# Altium project PhaseShifter.PrjPcb (part 2 of 2)

## Sheet Demod.SchDoc
size 431 x 279 mm; PartNumber: PNXXXXXXX; Organization: ORGANIZATION; Address1: 207; Address2: 13399 104 Ave; Address3: Surrey BC, V3T 0C9; Address4: Canada; Revision: V0.0.0; SheetNumber: 2; SheetTotal: 3; ENG_APP_DATE: --/--/--; DSN_APP_DATE: --/--/--; CHK_APP_DATE: --/--/--
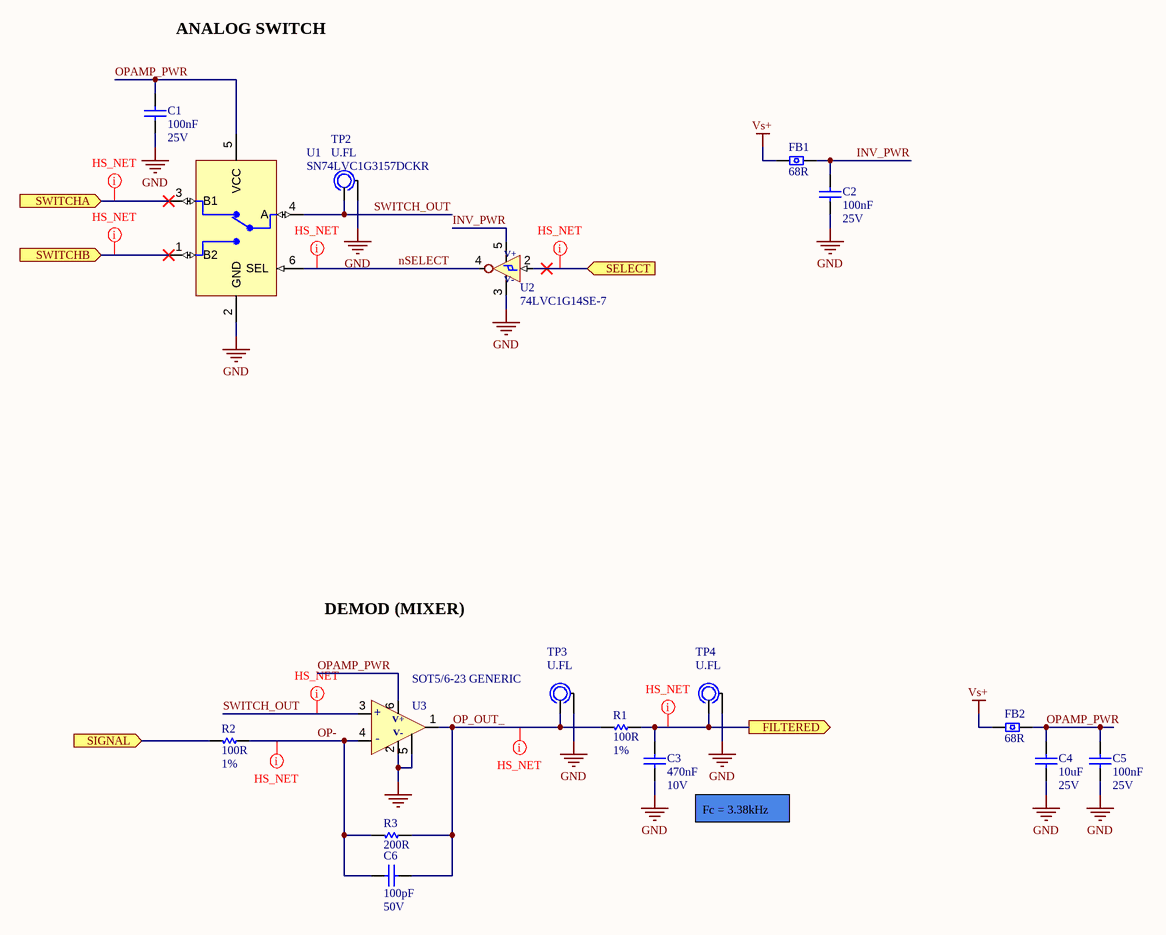
[diagram p1: Demod.SchDoc]

### Parts
C1  100nF  Voltage Rating: 25V  [C0402]
C2  100nF  Voltage Rating: 25V  [C0402]
C3  470nF  Voltage Rating (DC): 10V  [C0402]
C4  10uF  Voltage Rating: 25V  [c0805]
C5  100nF  Voltage Rating: 25V  [C0402]
C6  100pF  Voltage Rating (DC): 50V  [C0402]
FB1  68R  [FB0402]
FB2  68R  [FB0402]
R1  100R  Tolerance: 1%  [R0402]
R2  100R  Tolerance: 1%  [R0402]
R3  200R  [R0402]
TP2  U.FL  [U.FL]
TP3  U.FL  [U.FL]
TP4  U.FL  [U.FL]
U1  SN74LVC1G3157DCKR  [SC70-6]
U2  74LVC1G14SE-7  [SC70 5pin TI DCK]
U3  SOT5/6-23 GENERIC  [SOT23-5/6_Modified]

### Ports
FILTERED (out), SELECT (in), SIGNAL (in), SWITCHA (in), SWITCHB (in)

### Nets
GND: C1.2 C2.2 C3.1 C4.1 C5.2 TP2.0 TP3.0 TP4.0 U1.2(GND) U2.3(GND) U3.2(V-) U3.5
Vbias: U1.3(B1) ; port SWITCHA
Vs+: FB1.2 FB2.2
CLOCK: U2.2(A) ; port SELECT
INV_PWR: C2.1 FB1.1 U2.5(PWR)
nSELECT: U1.6(SEL) U2.4(Y)
OP-: C6.2 R2.1 R3.2 U3.4(-)
OP_OUT_: C6.1 R1.2 R3.1 TP3.1 U3.1
OPAMP_PWR: C1.1 C4.2 C5.1 FB2.1 U1.5(VCC) U3.6(V+)
OSIG_I: C3.2 R1.1 TP4.1 ; port FILTERED
PHASE_DELAY: R2.2 U1.1(B2) ; port SIGNAL, port SWITCHB
SWITCH_OUT: TP2.1 U1.4(A) U3.3(+)

### Layout directives
net class HS_NET; rule Clearance Constraint [Generic clearance = 10mil, and 30 value(s) for objects]; rule Impedance Constraint [Min = 42.50    Max = 57.50    ]: CLOCK, nSELECT, OP-, OP_OUT_, OSIG_I, PHASE_DELAY, SWITCH_OUT, Vbias

### Notes on the sheet
- ANALOG SWITCH
- DEMOD (MIXER)
- (near C3) Fc = 3.38kHz
- REV:
- PROJECT:
- DATE:
- TITLE
- SHEET
- OF
- DESIGNED:
- REVIEWED:
- (in symbol IC LOGIC INVERTER 32mA) V+; V-

### Library data of the parts
C1 C2 C5 = CAP CER 100nF 25V X5R 0402: Cap Ceramic 0.1uF 25V X5R 10% Pad SMD 0402 85¡ãC T/R / Multi Layer Ceramic Capacitor (MLCC); Manufacturer: Samsung; Manufacturer Part Number: CL05A104KA5NNNC; Supplier 1: Digi-Key; RoHS: Yes; Category: Ceramic Capacitors; Stock 1: 8053194; Pricing 1: 1=0.10000, 10=0.01100, 50=0.00600, 100=0.00490, 500=0.00346, 1000=0.00272, 2500=0.00248, 5000=0.00228 (USD); Mount: Surface Mount; Case/Package: 0402; Case Code (Metric): 1005; Case Code (Imperial): 0402; Min Operating Temperature: -55°C; Max Operating Temperature: 85°C; Capacitance: 100nF; Tolerance: 10%; Dielectric: X5R; Packaging: Tape and Reel; Package Quantity: 1; Voltage: 25V; Series: CL; Construction: Flat; Voltage Rating (DC): 25V; Length: 1mm; Width: 0.02inch; Height: 0.5mm; Thickness: 0.022inch; Depth: 0.5mm; Radiation Hardening: No; Lead Free: Lead Free; ComponentLink1URL: https://datasheet.ciiva.com/25802/cl05a104ka5nnnc-25802704.pdf?src-supplier=Digi-Key; ComponentLink1Description: https://datasheet.ciiva.com/25802/cl05a104ka5nnnc-25802704.pdf?src-supplier=Digi-Key; ComponentLink2URL: https://datasheet.ciiva.com/26838/getdatasheetpartid-357412-26838142.pdf?src-supplier=Verical; ComponentLink2Description: https://datasheet.ciiva.com/26838/getdatasheetpartid-357412-26838142.pdf?src-supplier=Verical; ComponentLink3URL: https://datasheet.ciiva.com/16437/cl05a104ka5nnnc-16437369.pdf?src-supplier=Future+Electronics; ComponentLink3Description: https://datasheet.ciiva.com/16437/cl05a104ka5nnnc-16437369.pdf?src-supplier=Future+Electronics; ComponentLink4URL: https://datasheet.ciiva.com/26309/mlcc-catalogdownload2013-eng-26309014.pdf?src-supplier=Distrelec; ComponentLink4Description: https://datasheet.ciiva.com/26309/mlcc-catalogdownload2013-eng-26309014.pdf?src-supplier=Distrelec; Supplier Part Number 1: 1276-1043-1-ND
C3 = CAP CER 470nF 10V X7R 0402: Multilayer Ceramic Capacitor, 0.47 uF, 50 V, ± 2%, C0G (NP0), 0402 [1005 Metric]; Manufacturer 1: Yageo; Manufacturer Part Number 1: CC0402KRX7R6BB474; Category 1: Ceramic Capacitors; Tolerance: 10%; Dielectric: X7R; Supplier 1: Newark; Supplier Part Number 1: 09AK0987; RoHS 1: Yes; Description 1: Multilayer Ceramic Capacitor, 0.47 uF, 50 V, ± 2%, C0G (NP0), 0402 [1005 Metric]; Stock 1: 9400; Pricing 1: 1=0.238, 10=0.142 (USD); Mounting Technology: Surface Mount; Case/Package: 0402; Min Operating Temperature: -55°C; Max Operating Temperature: 125°C; Packaging: Tape and Reel; Value: 470nF; Voltage Rating: 10V; Series: CC; Length: 0.039inch; Width: 0.02inch; Thickness: 0.022inch; Lead Free: Lead Free; Halogen Free: Halogen Free; RoHS Compliant: Yes; ComponentLink1URL: http://www.yageo.com/documents/recent/UPY-GPHC_X7R_6.3V-to-50V_18.pdf?src-supplier=Digi-Key; ComponentLink1Description: http://www.yageo.com/documents/recent/UPY-GPHC_X7R_6.3V-to-50V_18.pdf?src-supplier=Digi-Key; ComponentLink2URL: https://datasheet.octopart.com/CC0402KRX7R6BB474-Yageo-datasheet-151948686.pdf?src-supplier=Farnell; ComponentLink2Description: https://datasheet.octopart.com/CC0402KRX7R6BB474-Yageo-datasheet-151948686.pdf?src-supplier=Farnell; ComponentLink3URL: https://datasheet.octopart.com/CC0402KRX7R6BB474-Yageo-datasheet-166511530.pdf?src-supplier=Future+Electronics; ComponentLink3Description: https://datasheet.octopart.com/CC0402KRX7R6BB474-Yageo-datasheet-166511530.pdf?src-supplier=Future+Electronics
C4 = CAP CER 10uF 25V X5R 0805: Cap Ceramic 10uF 25V X5R 10% SMD 0805 85°C Embossed T/R; Manufacturer: Samsung; Manufacturer Part Number: CL21A106KAYNNNE; Supplier 1: Digi-Key; RoHS: Yes; Category: Ceramic Capacitors; Stock 1: 2266338; Pricing 1: 2000=0.03549, 4000=0.03247 (USD); Mount: Surface Mount; Case/Package: 0805; Case Code (Metric): 2012; Case Code (Imperial): 0805; Min Operating Temperature: -55°C; Max Operating Temperature: 85°C; Package Quantity: 1; Packaging: Tape and Reel; Capacitance: 10uF; Tolerance: 10%; Dielectric: X5R; Series: CL; Construction: Flat; Length: 2mm; Width: 0.049inch; Height: 1.25mm; Depth: 1.25mm; Thickness: 0.057inch; Radiation Hardening: No; RoHS Compliant: Yes; ComponentLink1URL: https://datasheet.ciiva.com/25796/cl21a106kaynnne-25796720.pdf?src-supplier=Digi-Key; ComponentLink1Description: https://datasheet.ciiva.com/25796/cl21a106kaynnne-25796720.pdf?src-supplier=Digi-Key; ComponentLink2URL: https://datasheet.ciiva.com/26838/getdatasheetpartid-357558-26838583.pdf?src-supplier=Verical; ComponentLink2Description: https://datasheet.ciiva.com/26838/getdatasheetpartid-357558-26838583.pdf?src-supplier=Verical; Supplier Part Number 1: 1276-2891-2-ND
C6 = CAP CER 100pF 50V C0G 0402: 0402 100 pF 50 V ±5% Tolerance NP0/C0G Multilayer Ceramic Chip Capacitor; Manufacturer: Yageo; Manufacturer Part Number: CC0402JPNPO9BN101; Dielectric: C0G; Supplier 1: Digi-Key; RoHS: Yes; Category: Ceramic Capacitors; Stock 1: 83787; Pricing 1: 1=0.10000, 10=0.01900, 50=0.01040, 100=0.00850, 500=0.00604, 1000=0.00475, 2500=0.00432, 5000=0.00397 (USD); Case/Package: 0402; Case Code (Imperial): 0402; Case Code (Metric): 1005; Weight: 2.3E-05oz; Min Operating Temperature: -55°C; Max Operating Temperature: 125°C; Tolerance: 5%; Packaging: Tape and Reel; Capacitance: 100pF; Termination: SMD/SMT; Resistor Type: Ceramic; Length: 1mm; Width: 0.5mm; Depth: 0.5mm; RoHS Compliant: Yes; ComponentLink1URL: http://www.mouser.com/ds/2/447/Yageo_UPY-GP_NP0_16V-to-50V_9-358835.pdf?src-supplier=Mouser; ComponentLink1Description: http://www.mouser.com/ds/2/447/Yageo_UPY-GP_NP0_16V-to-50V_9-358835.pdf?src-supplier=Mouser; ComponentLink2URL: http://components.arrow.com/part/dataview/0323_04038301?src-supplier=Arrow+Europe; ComponentLink2Description: http://components.arrow.com/part/dataview/0323_04038301?src-supplier=Arrow+Europe; Supplier Part Number 1: 13-CC0402JPNPO9BN101CT-ND
FB1 FB2 = FB 68R 400mA 310mR 0402: Ferrite Beads Multi-Layer 68Ohm 25% 100MHz 400mA 310mOhm DCR 0402 T/R; Manufacturer: Taiyo Yuden; Manufacturer Part Number: BK1005LL680-T; DC Resistance (DCR): 310mR; Number of Lines: 1; Shielding: Unshielded; Supplier 1: Digi-Key; RoHS: Yes; Category: Ferrite Beads and Chips; Stock 1: 9707; Pricing 1: 1=0.10000, 10=0.04100, 25=0.03640, 50=0.03300, 100=0.02970, 250=0.02176, 500=0.01584, 1000=0.01551, 5000=0.01056 (USD); Mount: Surface Mount; Case/Package: 0402; Number of Pins: 2; Case Code (Metric): 1005; Case Code (Imperial): 0402; Core Material: Ferrite; Min Operating Temperature: -55°C; Max Operating Temperature: 125°C; Packaging: Tape and Reel; Package Quantity: 1; Impedance: 68R; Tolerance: 25%; Max DC Current: 400mA; Termination: SMD/SMT; Test Frequency: 100MHz; Max Current Rating: 400mA; Series: BK; Frequency: 100MHz; Length: 0.039inch; Width: 0.02inch; Height: 0.022inch; Depth: 0.55mm; Halogen Free: Halogen Free; Lead Free: Lead Free; REACH SVHC: Unknown; ComponentLink1URL: https://datasheet.ciiva.com/1013/bk1005ll680-t-ss-1013936.pdf?src-supplier=Digi-Key; ComponentLink1Description: https://datasheet.ciiva.com/1013/bk1005ll680-t-ss-1013936.pdf?src-supplier=Digi-Key; ComponentLink2URL: https://datasheet.ciiva.com/1013/mlci07-e-1013935.pdf?src-supplier=Digi-Key; ComponentLink2Description: https://datasheet.ciiva.com/1013/mlci07-e-1013935.pdf?src-supplier=Digi-Key; ComponentLink3URL: https://datasheet.ciiva.com/1013/mlci07-e-1013937.pdf?src-supplier=Digi-Key; ComponentLink3Description: https://datasheet.ciiva.com/1013/mlci07-e-1013937.pdf?src-supplier=Digi-Key; Supplier Part Number 1: 587-1860-1-ND
R1 R2 = RES 100R 63mW 1% 0402: Res General Purpose Thick Film 0402 100 Ohm 1% 1/16W ±100ppm/°C Molded SMD Paper T/R; Manufacturer: Yageo; Manufacturer Part Number: RC0402FR-07100RL; Power Rating: 62.5mW; Voltage Rating: 50V; Max Power Dissipation: 63mW; Supplier 1: Newark; RoHS: Yes; Category: Chip SMD Resistors; Stock 1: 4390000; Pricing 1: 1=0.00100, 10000=0.00100 (USD); Case/Package: 0402; Number of Pins: 2; Case Code (Imperial): 0402; Case Code (Metric): 1005; Size Code: 0402; Min Operating Temperature: -55°C; Max Operating Temperature: 155°C; Voltage Rating (DC): 50V; Resistance: 100R; Packaging: Tape and Reel; Termination: SMD/SMT; Resistor Type: Thick Film; Temperature Coefficient: 100ppm/°C; Features: Moisture Resistant; Series: RC; Number of Terminations: 2; Resistance Tolerance: 1%; Construction: Rectangular; Technology: THICK FILM; Length: 1mm; Width: 0.5mm; Height: 0.32mm; Depth: 0.5mm; RoHS Compliant: Yes; Reach SVHC Compliant: Yes; Military Standard: Not; Lead Free: Lead Free; ComponentLink1URL: https://datasheet.ciiva.com/11808/0900766b80c66297-11808765.pdf?src-supplier=RSComponents; ComponentLink1Description: https://datasheet.ciiva.com/11808/0900766b80c66297-11808765.pdf?src-supplier=RSComponents; ComponentLink2URL: https://datasheet.ciiva.com/7849/1784430-7849810.pdf?src-supplier=Element14; ComponentLink2Description: https://datasheet.ciiva.com/7849/1784430-7849810.pdf?src-supplier=Element14; ComponentLink3URL: https://datasheet.ciiva.com/28367/1018594-28367226.pdf?src-supplier=Element14; ComponentLink3Description: https://datasheet.ciiva.com/28367/1018594-28367226.pdf?src-supplier=Element14; ComponentLink4URL: https://datasheet.ciiva.com/22747/1018594-22747511.pdf?src-supplier=Element14; ComponentLink4Description: https://datasheet.ciiva.com/22747/1018594-22747511.pdf?src-supplier=Element14; ComponentLink5URL: https://datasheet.ciiva.com/12667/pyu-rc0402-51-rohs-l-6-r-12667957.pdf?src-supplier=Mouser; ComponentLink5Description: https://datasheet.ciiva.com/12667/pyu-rc0402-51-rohs-l-6-r-12667957.pdf?src-supplier=Mouser; ComponentLink6URL: https://datasheet.ciiva.com/15189/getdatasheetpartid-329466-15189335.pdf?src-supplier=Verical; ComponentLink6Description: https://datasheet.ciiva.com/15189/getdatasheetpartid-329466-15189335.pdf?src-supplier=Verical; ComponentLink7URL: https://datasheet.ciiva.com/16740/pyu-rc0402-51-rohs-l-6-r-16740566.pdf?src-supplier=Future+Electronics; ComponentLink7Description: https://datasheet.ciiva.com/16740/pyu-rc0402-51-rohs-l-6-r-16740566.pdf?src-supplier=Future+Electronics; Supplier Part Number 1: 45Y6897
R3 = RES 200R 1% 63mW 0402: SMD Chip Resistor, 200 Ohm, ± 1%, 63 mW, 0402 [1005 Metric], Thick Film, General Purpose; Manufacturer 1: Yageo; Manufacturer Part Number 1: RC0402FR-07200RL; Category 1: Chip SMD Resistors; Temperature Coefficient: 100ppm/°C; Power Rating: 63mW; Voltage Rating (DC): 50V; Supplier 1: Future Electronics; Supplier Part Number 1: 5740899; RoHS 1: Yes; Description 1: SMD Chip Resistor, 200 Ohm, ± 1%, 63 mW, 0402 [1005 Metric], Thick Film, General Purpose; Stock 1: 4960000; Pricing 1: 10000=0.0012, 50000=0.0011, 300000=0.0011, 1000000=0.001, 3000000=0.0009 (USD); Case/Package: 0402; Case Code (Metric): 1005; Case Code (Imperial): 0402; Min Operating Temperature: -55°C; Max Operating Temperature: 155°C; Tolerance: 1%; Packaging: Tape and Reel; Value: 200R; Resistor Type: Thick Film; Termination: SMD/SMT; Voltage Rating: 50V; Package Quantity: 1; Number of Terminations: 2; Max Power Dissipation: 63mW; Features: Moisture Resistant; Series: RC; Construction: Rectangular; Resistance Tolerance: 1%; Length: 1mm; Width: 0.02inch; Height: 0.016inch; Depth: 0.5mm; RoHS Compliant: Yes; Reach SVHC Compliant: No; Lead Free: Lead Free; Military Standard: Not; ComponentLink1URL: https://datasheet.ciiva.com/7849/1018594-7849899.pdf?src-supplier=Element14; ComponentLink1Description: https://datasheet.ciiva.com/7849/1018594-7849899.pdf?src-supplier=Element14; ComponentLink2URL: https://datasheet.ciiva.com/7849/1018594-7849898.pdf?src-supplier=Element14; ComponentLink2Description: https://datasheet.ciiva.com/7849/1018594-7849898.pdf?src-supplier=Element14; ComponentLink3URL: https://datasheet.ciiva.com/7983/1018594-7983509.pdf?src-supplier=Element14; ComponentLink3Description: https://datasheet.ciiva.com/7983/1018594-7983509.pdf?src-supplier=Element14; ComponentLink4URL: https://datasheet.ciiva.com/2553/pyu-r-int-thick-7-2553231.pdf?src-supplier=Digi-Key; ComponentLink4Description: https://datasheet.ciiva.com/2553/pyu-r-int-thick-7-2553231.pdf?src-supplier=Digi-Key; ComponentLink5URL: https://datasheet.ciiva.com/2553/pyu-r-int-thick-7-2553232.pdf?src-supplier=Digi-Key; ComponentLink5Description: https://datasheet.ciiva.com/2553/pyu-r-int-thick-7-2553232.pdf?src-supplier=Digi-Key; ComponentLink6URL: https://datasheet.ciiva.com/2553/pyu-r-int-thick-7-2553230.pdf?src-supplier=Digi-Key; ComponentLink6Description: https://datasheet.ciiva.com/2553/pyu-r-int-thick-7-2553230.pdf?src-supplier=Digi-Key; ComponentLink7URL: https://datasheet.ciiva.com/5562/pyu-rc0402-51-rohs-l-6-r-8721-5562539.pdf?src-supplier=Mouser; ComponentLink7Description: https://datasheet.ciiva.com/5562/pyu-rc0402-51-rohs-l-6-r-8721-5562539.pdf?src-supplier=Mouser; ComponentLink8URL: https://datasheet.ciiva.com/16804/pyu-rc0402-51-rohs-l-6-r-16804406.pdf?src-supplier=Future+Electronics; ComponentLink8Description: https://datasheet.ciiva.com/16804/pyu-rc0402-51-rohs-l-6-r-16804406.pdf?src-supplier=Future+Electronics; ComponentLink9URL: https://datasheet.ciiva.com/15189/getdatasheetpartid-331152-15189383.pdf?src-supplier=Verical; ComponentLink9Description: https://datasheet.ciiva.com/15189/getdatasheetpartid-331152-15189383.pdf?src-supplier=Verical
TP2-TP4 = TP U.FL: CONN U.FL RCPT STR 50 OHM SMD; Manufacturer: Hirose; Manufacturer Part Number: U.FL-R-SMT-1(80); Body Material: Bronze; Body Plating: Silver; Center Contact Plating: Gold; Dielectric Material: Polymer; Connector Type: Receptacle,Male Pin; Impedance: 50R; Max Frequency: 6GHz; Number of Ports: 1; Mating Cycles: 30; Supplier 1: Future Electronics; RoHS: Yes; Category: RF / Coaxial Connectors; Stock 1: 40000; Pricing 1: 10000=0.81500, 20000=0.80000, 30000=0.78500 (USD); Mount: Surface Mount; Case/Package: SMD/SMT; Contact Material: Brass; Housing Color: Beige; Min Operating Temperature: -40°C; Max Operating Temperature: 90°C; Package Quantity: 10000; Packaging: Tape and Reel; Fastening Type: SNAP-ON; Series: U.FL; Termination: Solder; Lead Free: Lead Free; RoHS Compliant: Yes; ComponentLink1URL: http://www.mouser.com/ds/2/185/U.FL_catalog-939761.pdf?src-supplier=Mouser; ComponentLink1Description: http://www.mouser.com/ds/2/185/U.FL_catalog-939761.pdf?src-supplier=Mouser; ComponentLink2URL: https://www.hirose.com/product/en/download_file/key_name/U.FL-R-SMT-1%2880%29/category/Specification%20Sheet/doc_file_id/37638/?file_category_id=9&item_id=03310472280&is_series=&src-supplier=Digi-Key; ComponentLink2Description: https://www.hirose.com/product/en/download_file/key_name/U.FL-R-SMT-1%2880%29/category/Specification%20Sheet/doc_file_id/37638/?file_category_id=9&item_id=03310472280&is_series=&src-supplier=Digi-Key
U1 = IC AN SWITCH SPDT 340MHz 15R SN74LVC1G3157DCKR: 5-V, 2: 1 (SPDT), 1-channel general-purpose analog switch 6-SC70 -40 to 125; Manufacturer 1: Texas Instruments; Category 1: Interface ICs; Min Supply Voltage: 1.65V; Max Supply Voltage: 5.5V; Number of Channels: 1; Bandwidth: 300MHz; Number of Outputs: 2; Turn-On Delay Time: 5.7ns; Turn-Off Delay Time: 3.8ns; Max Supply Current: 10uA; Supply Type: Single; Propagation Delay: 300ps; -3db Bandwidth: 340MHz; Supplier 1: Mouser; Supplier Part Number 1: 595-SN74LVC1G3157DCK; Manufacturer Part Number 1: SN74LVC1G3157DCKR; RoHS 1: Yes; Description 1: 5-V, 2: 1 (SPDT), 1-channel general-purpose analog switch 6-SC70 -40 to 125; Stock 1: 368361; Pricing 1: 1=0.34, 10=0.22, 50=0.22, 100=0.118, 1000=0.086, 10000=0.051 (USD); Mounting Technology: Surface Mount; Case/Package: SC; Pins: 6; Weight: 8.8E-05oz; Min Operating Temperature: -40°C; Max Operating Temperature: 125°C; Packaging: Tape and Reel; Number of Inputs: 1; Termination: SMD/SMT; Number of Bits: 1; Series: -; Number of Circuits: 1; Supply Current: 10uA; Length: 2mm; Width: 1.25mm; Height: 0.9mm; Radiation Hardening: No; RoHS Compliant: Yes; Reach SVHC Compliant: No; Lead Free: Lead Free; ComponentLink1URL: https://datasheet.ciiva.com/34301/756764-34301477.pdf?src-supplier=Jameco; ComponentLink1Description: https://datasheet.ciiva.com/34301/756764-34301477.pdf?src-supplier=Jameco; ComponentLink2URL: https://datasheet.ciiva.com/15127/getdatasheetpartid-187022-15127388.pdf?src-supplier=Verical; ComponentLink2Description: https://datasheet.ciiva.com/15127/getdatasheetpartid-187022-15127388.pdf?src-supplier=Verical; ComponentLink3URL: https://datasheet.ciiva.com/41461/001187224-da-01-en-ic-switch-sn74lvc1g3157dckr-sc-70-6-tid-41461882.pdf?src-supplier=Conrad; ComponentLink3Description: https://datasheet.ciiva.com/41461/001187224-da-01-en-ic-switch-sn74lvc1g3157dckr-sc-70-6-tid-41461882.pdf?src-supplier=Conrad; ComponentLink4URL: https://datasheet.ciiva.com/1514/1857156-1514550.pdf?src-supplier=Element14; ComponentLink4Description: https://datasheet.ciiva.com/1514/1857156-1514550.pdf?src-supplier=Element14; ComponentLink5URL: https://datasheet.ciiva.com/46411/1786793-46411528.pdf?src-supplier=Element14; ComponentLink5Description: https://datasheet.ciiva.com/46411/1786793-46411528.pdf?src-supplier=Element14; ComponentLink6URL: https://datasheet.ciiva.com/1669/sn74lvc1g3157-1669381.pdf?src-supplier=Digi-Key; ComponentLink6Description: https://datasheet.ciiva.com/1669/sn74lvc1g3157-1669381.pdf?src-supplier=Digi-Key; ComponentLink7URL: https://datasheet.ciiva.com/1669/sn74lvc1g3157-1669380.pdf?src-supplier=Digi-Key; ComponentLink7Description: https://datasheet.ciiva.com/1669/sn74lvc1g3157-1669380.pdf?src-supplier=Digi-Key; ComponentLink8URL: https://datasheet.ciiva.com/1669/sn74lvc1g3157-1669382.pdf?src-supplier=Digi-Key; ComponentLink8Description: https://datasheet.ciiva.com/1669/sn74lvc1g3157-1669382.pdf?src-supplier=Digi-Key; ComponentLink9URL: https://datasheet.ciiva.com/14435/sn74lvc1g3157-14435733.pdf?src-supplier=Avnet; ComponentLink9Description: https://datasheet.ciiva.com/14435/sn74lvc1g3157-14435733.pdf?src-supplier=Avnet
U2 = IC LOGIC INVERTER 32mA: 74LVC Series 5.5 V Surface Mount Single Schmitt-Trigger Inverter - SOT-353; Manufacturer 1: Diodes; Category 1: Logic Gates; Logic Function: Inverter,Schmitt Trigger; High Level Output Current: -32mA; Low Level Output Current: 32mA; Number of Elements: 1; Propagation Delay: 6.5ns; Max Supply Voltage: 5.5V; Min Supply Voltage: 1.65V; Quiescent Current: 200uA; Turn-On Delay Time: 14ns; Schmitt Trigger Input: Yes; Output Type: PUSH-PULL; Input Type: SCHMITT TRIGGER; Supplier 1: Future Electronics; Supplier Part Number 1: 9038438; Manufacturer Part Number 1: 74LVC1G14SE-7; RoHS 1: Yes; Description 1: 74LVC Series 5.5 V Surface Mount Single Schmitt-Trigger Inverter - SOT-353; Stock 1: 741000; Pricing 1: 3000=0.0324, 9000=0.0313, 30000=0.0301, 60000=0.0294, 120000=0.0282 (USD); Mounting Technology: Surface Mount; Case/Package: SOT-353; Pins: 5; Min Operating Temperature: -40°C; Max Operating Temperature: 125°C; Packaging: Tape and Reel; Output Current: 32mA; Number of Inputs: 1; Package Quantity: 3000; Number of Circuits: 1; Series: 74LVC; Technology: CMOS; Length: 2.2mm; Width: 1.35mm; Height: 1mm; Radiation Hardening: No; Reach SVHC Compliant: No; Lead Free: Lead Free; RoHS Compliant: Yes; ComponentLink1URL: https://datasheet.ciiva.com/22694/1718765-22694659.pdf?src-supplier=Element14; ComponentLink1Description: https://datasheet.ciiva.com/22694/1718765-22694659.pdf?src-supplier=Element14; ComponentLink2URL: https://datasheet.ciiva.com/1507/1718765-1507989.pdf?src-supplier=Element14; ComponentLink2Description: https://datasheet.ciiva.com/1507/1718765-1507989.pdf?src-supplier=Element14
U3 = IC OPAMP SOT5/6-23 GENERIC: Number of Channels: 1; RoHS: Yes; Category: Amplifiers - Op Amps, Buffer, Instrumentation; Mount: Surface Mount; Case/Package: SOT; Number of Pins: 6; Number of Circuits: 1; RoHS Compliant: Yes

## Nets that join several sheets
GND: PhaseShifter (39 pins), Demod (12 pins)
Vbias: PhaseShifter (8 pins), Demod (U1.3)
Vs+: PhaseShifter (7 pins), Demod (FB1.2 FB2.2)
CLOCK: PhaseShifter (C7.2 J7.1 R4.2), Demod (U2.2)
OSIG_I: PhaseShifter (R9.2), Demod (C3.2 R1.1 TP4.1)
PHASE_DELAY: PhaseShifter (J1.1 R7.1 U5.1), Demod (R2.2 U1.1)

## Assembly variants
V0.0.0: all parts fitted